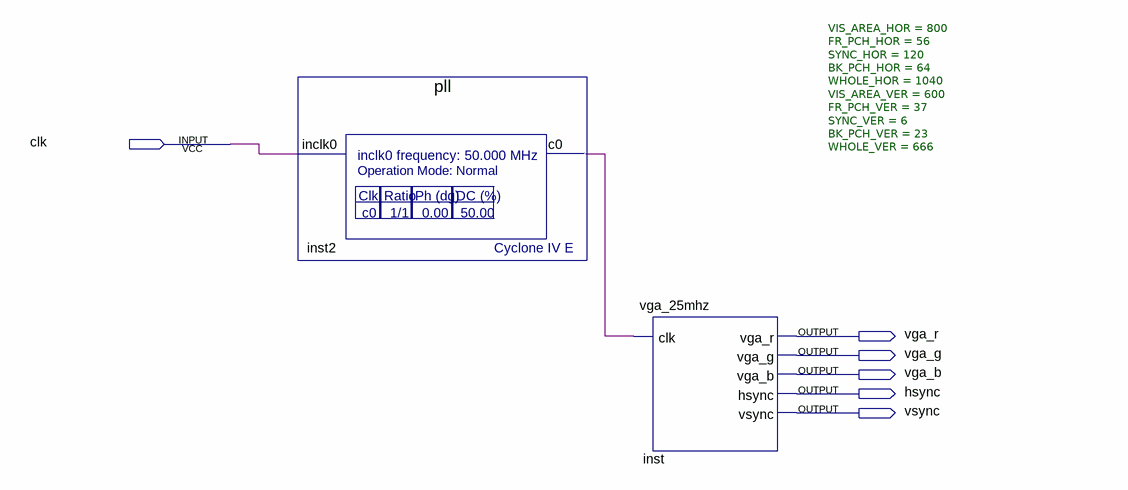
[diagram p0: schematic sheet]
// Quartus schematic Block1.bdf as structural Verilog: 2 symbols, 6 pins
module Block1 (
  input  clk,
  output vga_r,
  output vga_g,
  output vga_b,
  output hsync,
  output vsync
);

  wire inst2_c0;

  pll inst2 (.inclk0(clk), .c0(inst2_c0));
  vga_25mhz #(.VIS_AREA_HOR(800), .FR_PCH_HOR(56), .SYNC_HOR(120), .BK_PCH_HOR(64), .WHOLE_HOR(1040), .VIS_AREA_VER(600), .FR_PCH_VER(37), .SYNC_VER(6), .BK_PCH_VER(23), .WHOLE_VER(666)) inst (
    .clk(inst2_c0), .vga_r(vga_r), .vga_g(vga_g), .vga_b(vga_b), .hsync(hsync), .vsync(vsync));
endmodule
